# EAGLE design SHT2x_breakout (EAGLE 6.3)
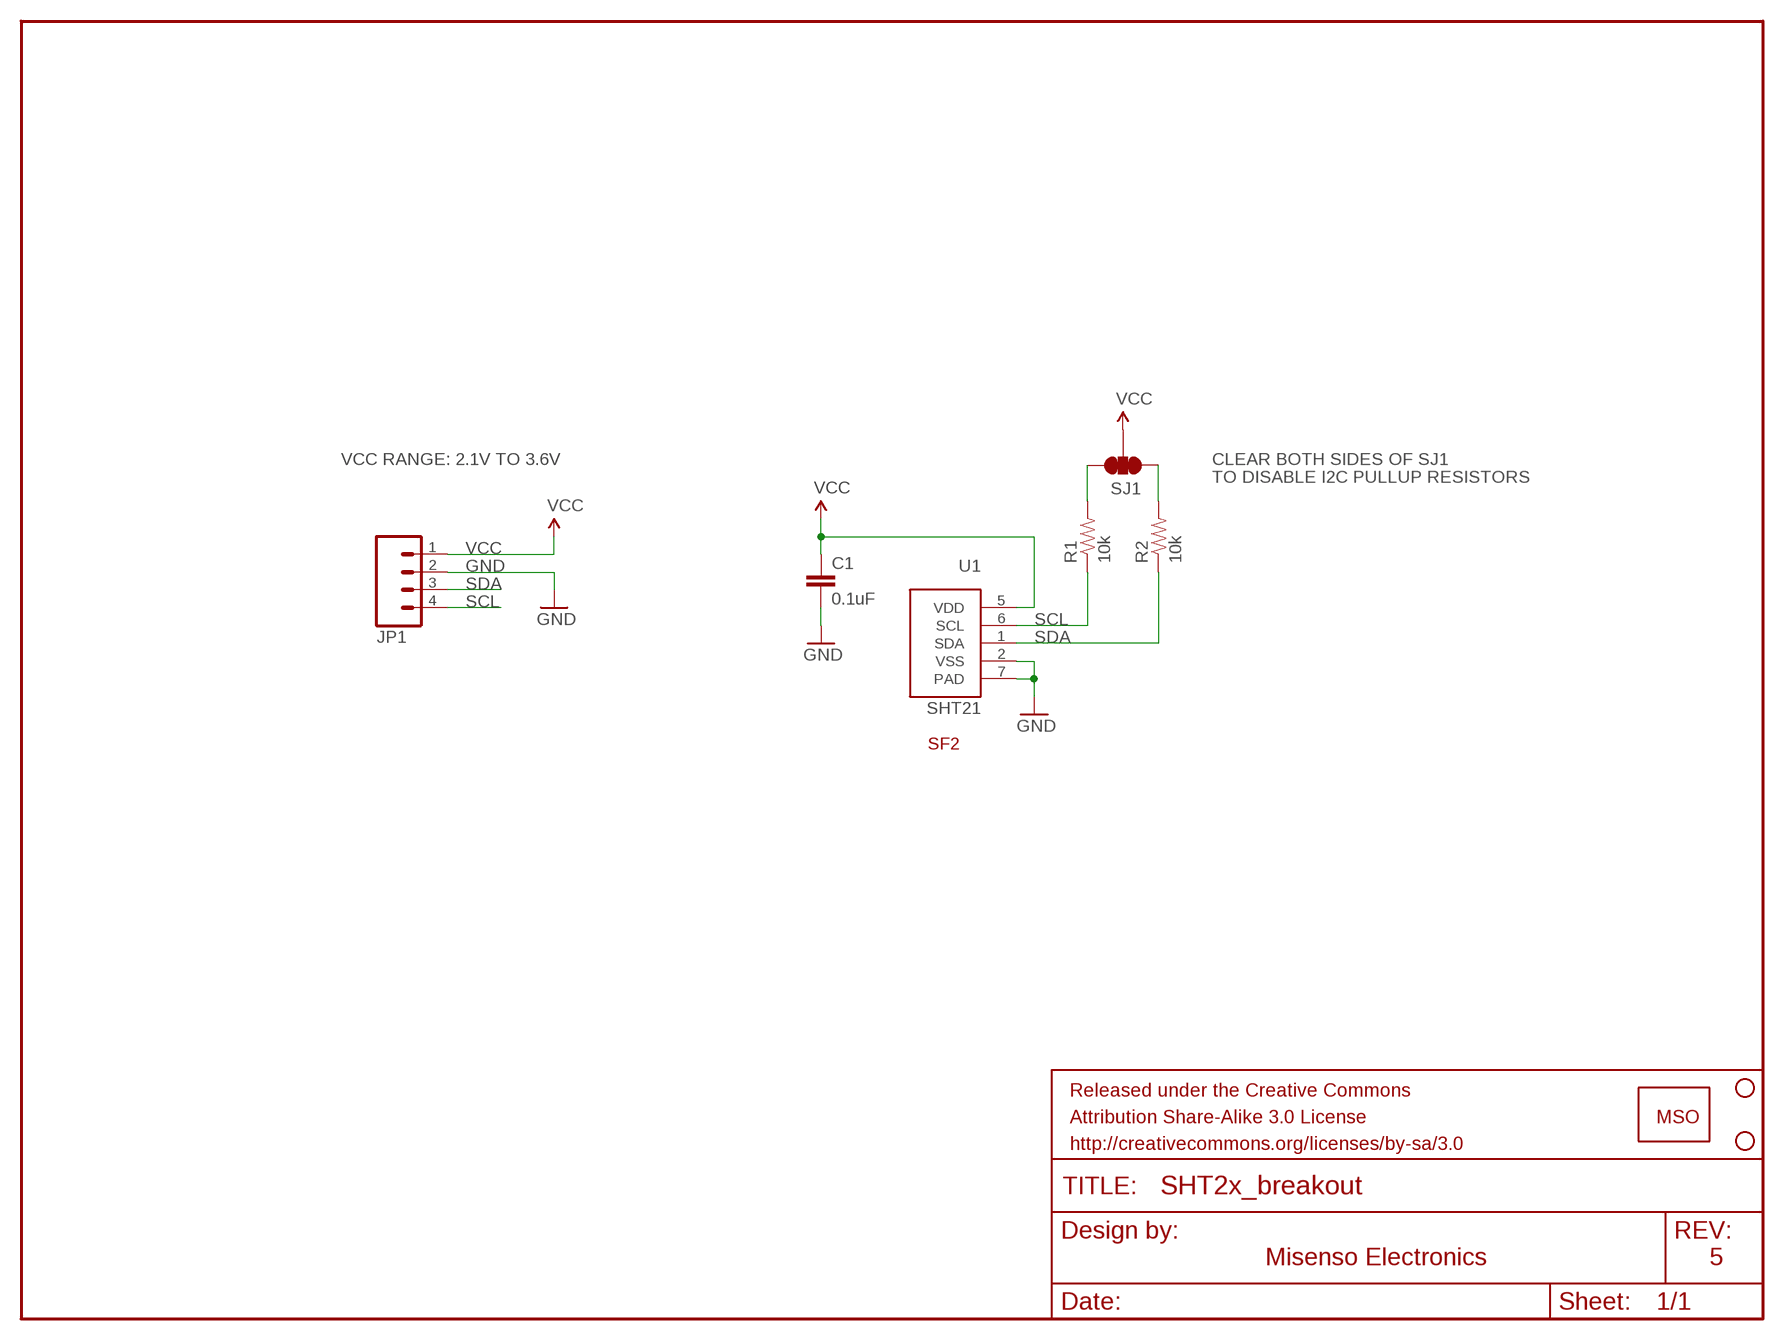
[diagram p0: schematic, sheet 1]

## Parts
C1  0.1uF  CAP0402-CAP  [0402-CAP]
JP1  M04PTH  [1X04]
R1  10k  RESISTOR0402-RES  [0402-RES]
R2  10k  RESISTOR0402-RES  [0402-RES]
SJ1  SOLDERJUMPER_2WAYPASTE1&2&3  [SJ_3_PASTE1&2&3]
STANDOFF1  STAND-OFF  [STAND-OFF]
STANDOFF2  STAND-OFF  [STAND-OFF]
U1  SHT21  SEN-SENSIRION-SHT2X  [SEN-SENSIRION-SHT2X]
U$2  MSO-LOGO  [MSO-LOGO]
U$3  MISC-SENSIRION-SF2  [MISC-SENSIRION-SF2]

## Nets
GND: C1.2 JP1.2 U1.2(VSS) U1.7(PAD)
N$1: R1.2 SJ1.3
N$2: R2.2 SJ1.1
SCL: JP1.4 R1.1 U1.6(SCL)
SDA: JP1.3 R2.1 U1.1(SDA)
VCC: C1.1 JP1.1 SJ1.2 U1.5(VDD)

## Notes on the sheet
- VCC RANGE: 2.1V TO 3.6V | CLEAR BOTH SIDES OF SJ1
- TO DISABLE I2C PULLUP RESISTORS
- Misenso Electronics | 5

## Library data of the parts
C1 = SparkFun:CAP: Capacitor Standard 0603 ceramic capacitor, and 0.1" leaded capacitor.
JP1 = SparkFun:M04: Header 4 Standard 4-pin 0.1" header. Use with straight break away headers (SKU : PRT-00116), right angle break away headers (PRT-00553), swiss pins (PRT-00743), machine pins (PRT-00117), and female headers (PRT-00115). Molex polarized connector foot print use with SKU : PRT-08231 with associated crimp pins and housings.
R1 R2 = SparkFun:RESISTOR: Resistor Basic schematic elements and footprints for 0603, 1206, and PTH resistors.
SJ1 = mike-temp:SOLDERJUMPER_2WAY: Solder Jumper 2 way solder jumper
STANDOFF1 STANDOFF2 = SparkFun-Electromechanical:STAND-OFF: #4 Stand Off This is the mechanical footprint for a #4 phillips button head screw. Use the keepout ring to avoid running the screw head into surrounding components. SKU : PRT-00447
U1 = Misenso:SEN-SENSIRION-SHT2X
U$2 = Misenso:MSO-LOGO
U$3 = Misenso:MISC-SENSIRION-SF2

## Board
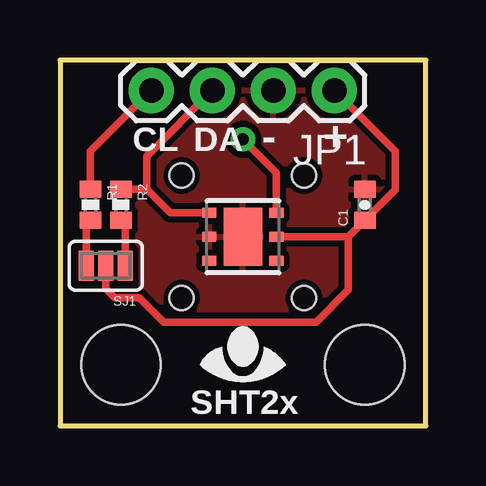
[diagram p1: board, top side]
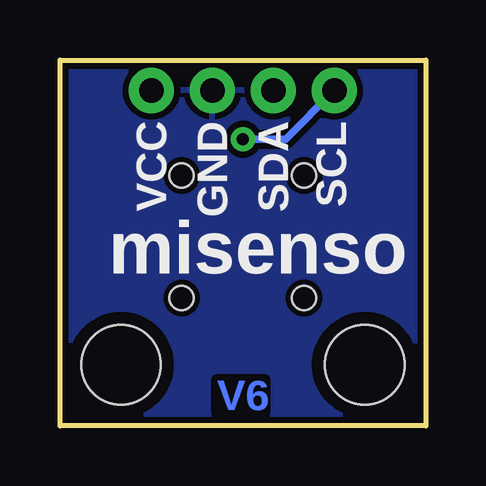
[diagram p2: board, bottom side, seen from below]

Size 15.24 x 15.24 mm. Coordinates in mm from the lower left corner, seen from the top.
Outline: 0,0 15.24,0 15.24,15.24 0,15.24 0,0
Copper layers (1*16): Top 0.035mm / dielectric 1.5mm / Bottom 0.035mm
Design rules "default": minimum track width 8mil, minimum drill 20mil, track to track 8mil, track to pad 8mil, pad to pad 8mil, via to via 8mil, smd to smd 8mil, copper to edge 8mil, drill to drill 8mil, minimum pad ring 12mil, minimum via ring 10mil, stop-mask expansion 4mil, vias tented up to drill 20mil, thermal gap 10mil

### Footprints (pad centres in the part's own frame; a part is rotated, then mirrored left to right if it is on the bottom)
0402-CAP = smd 0.7 x 0.9: 1 -0.65,0; 2 0.65,0
1X04 = drill 1.016 pad 1.88: 1 0,0; 2 2.54,0; 3 5.08,0; 4 7.62,0
0402-RES = smd 0.7 x 0.9: 1 -0.65,0; 2 0.65,0
SJ_3_PASTE1&2&3 = smd 0.635 x 1.27: 1 -0.813,0; 2 0,0; 3 0.813,0
STAND-OFF = hole 3.302: 0,0
SEN-SENSIRION-SHT2X = smd 0.4 x 0.6: 1 -1,-1.4; 2 0,-1.4; 3 1,-1.4; 4 1,1.4; 5 0,1.4; 6 -1,1.4 | smd 2.4 x 1.6: 7 0,0
MISC-SENSIRION-SF2 = hole 1: 2.55,2.55; -2.55,2.55; -2.55,-2.55; 2.55,-2.55

### Placement (x,y rotation side)
C1  12.7,9.21 90 top
JP1  11.43,13.97 180 top
R1  1.27,9.21 270 top
R2  2.54,9.21 270 top
SJ1  1.91,6.67 180 top
STANDOFF1  12.7,2.54 0 top
STANDOFF2  2.54,2.54 0 top
U1  7.62,7.87 270 top
U$2  7.62,1.78 0 top
U$3  7.62,7.87 90 top

### Tracks (layer width: path | path; a pad name or v marks a point on that pad's centre or on a via)
GND
  pour Top (isolate 0.254): 0,15.24 0,0 15.24,0 15.24,15.24
  pour Bottom (isolate 0.254): 0,15.24 0,0 15.24,0 15.24,15.24
N$1
  Top 0.305: SJ1.3 1.09,8.38 R1.2
N$2
  Top 0.305: SJ1.1 2.72,8.38 R2.2
SCL  (via drill 0.51)
  Top 0.305: R1.1 1.27,11.43 JP1.4 | v7.62,11.94 9.02,10.54 U1.6
  Bottom 0.305: v7.62,11.94 5.84,11.94 JP1.4
SDA
  Top 0.305: 3.6,9.86 4.59,8.87 U1.1 | 3.6,9.86 3.6,11.22 JP1.3 | 3.6,9.86 R2.1
VCC
  Top 0.305: 12.02,7.87 C1.1 13.97,9.83 13.97,11.43 JP1.1 | 12.02,7.87 12.02,5.67 10.67,4.32 4.32,4.32 3.3,5.33 2.29,5.33 1.91,5.71 SJ1.2 | 12.02,7.87 U1.5

### Text on the board
Bottom: V6
tPlace: CL | DA | - | + | SHT2x
bPlace: SCL | SDA | GND | VCC | misenso
Document: 0.00" | 0.10" | 0.50" | 0.60" | 0.60" | 0.10" | 0.125" DIA X 2 | 0.00"